# Altium schematic sheet Peripherals connectors.SchDoc
size A; SheetNumber: 3
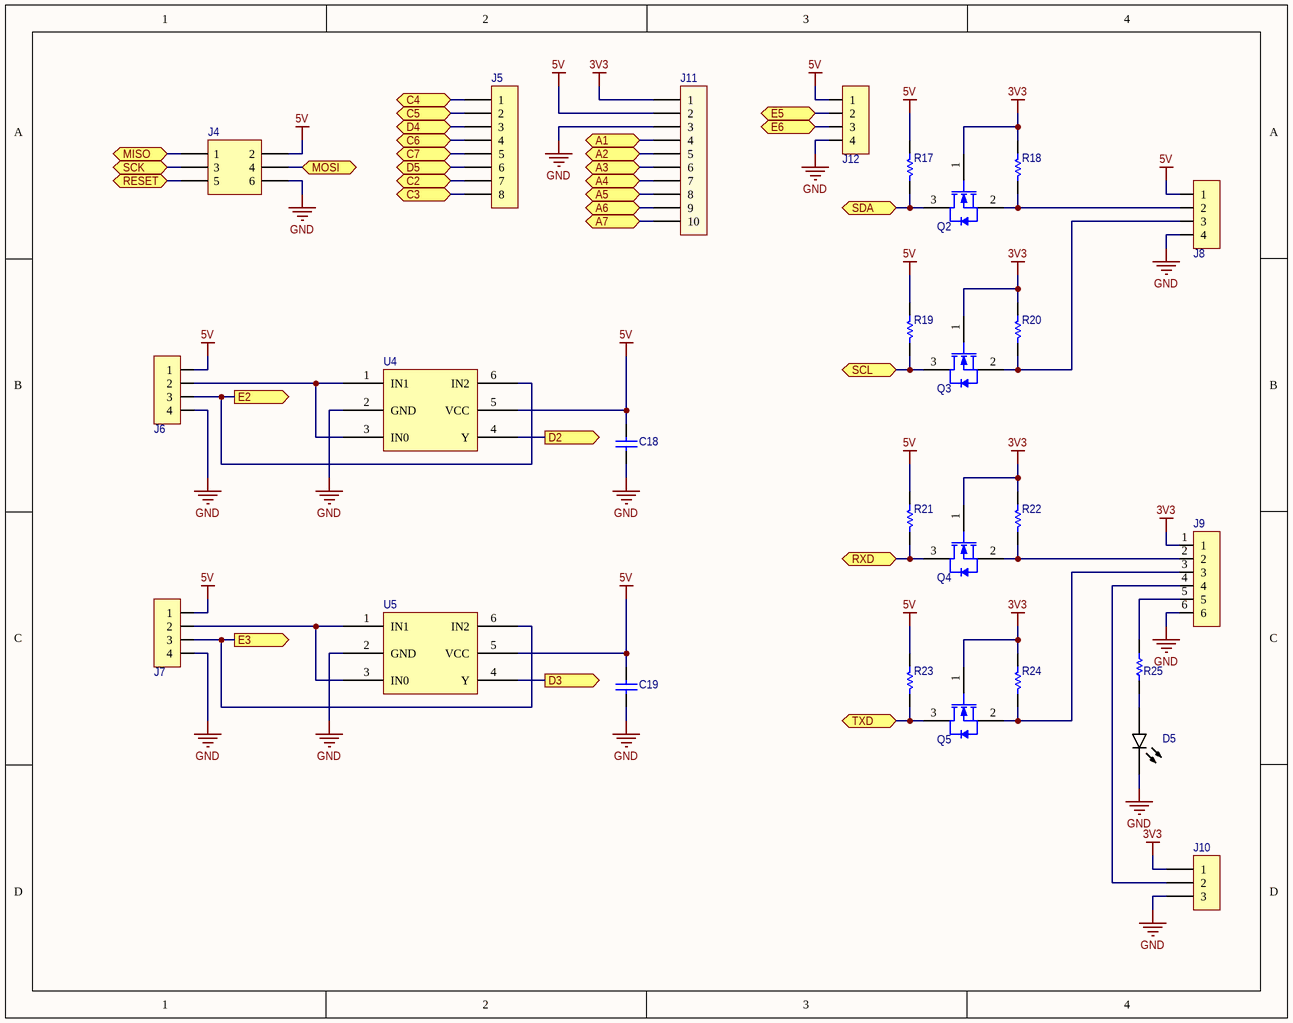
[diagram p0: Peripherals connectors.SchDoc]

## Parts
C18  Kemet C1206C104K5RACAUTO  [CAPC3216X88X50ML20T25]  (value not drawn)
C19  Kemet C1206C104K5RACAUTO  [CAPC3216X88X50ML20T25]  (value not drawn)
D5  Lite-On LTST-C170TBKT  [CHIPLED  0805 BLUE]  (value not drawn)
J4  FCI 67996-206HLF  [PCB-av458rj4t6vupn2hcvqe-1]  (value not drawn)
J5  Samtec MMS-108-01-L-SV  [PCB-goc1bdntoqdy8u4hrzei-1]  (value not drawn)
J6  4pin header  [PCBComponent_1 - duplicate]  (value not drawn)
J7  4pin header  [PCBComponent_1 - duplicate]  (value not drawn)
J8  4pin header  [PCBComponent_1 - duplicate]  (value not drawn)
J9  TE Connectivity / AMP 3-644456-5  [PCB-oudem42uhcimrbfznktg-1]  (value not drawn)
J10  Molex 75757-0431  [Molex 75757-0431]  (value not drawn)
J11  Jameco Valuepro 7000-1X10SG-R  [PCB-pv1vym0ok8u0vunn5wic-1]  (value not drawn)
J12  4pin header  [PCBComponent_1 - duplicate]  (value not drawn)
Q2  SYM-ec4d21f6be82338a-2  [PCB-fnvh88uh0gwuonmuoobt-1]  (value not drawn)
Q3  SYM-ec4d21f6be82338a-2  [PCB-fnvh88uh0gwuonmuoobt-1]  (value not drawn)
Q4  SYM-ec4d21f6be82338a-2  [PCB-fnvh88uh0gwuonmuoobt-1]  (value not drawn)
Q5  SYM-ec4d21f6be82338a-2  [PCB-fnvh88uh0gwuonmuoobt-1]  (value not drawn)
R17  Res1  [PCB-r93x9swl7vzrlon1kcic-1]  (value not drawn)
R18  Res1  [PCB-r93x9swl7vzrlon1kcic-1]  (value not drawn)
R19  Res1  [PCB-r93x9swl7vzrlon1kcic-1]  (value not drawn)
R20  Res1  [PCB-r93x9swl7vzrlon1kcic-1]  (value not drawn)
R21  Res1  [PCB-r93x9swl7vzrlon1kcic-1]  (value not drawn)
R22  Res1  [PCB-r93x9swl7vzrlon1kcic-1]  (value not drawn)
R23  Res1  [PCB-r93x9swl7vzrlon1kcic-1]  (value not drawn)
R24  Res1  [PCB-r93x9swl7vzrlon1kcic-1]  (value not drawn)
R25  Vishay Dale CRCW12061K00FKEB  [RESC3216X60X45ML10T20]  (value not drawn)
U4  Diodes Inc. 74LVC1G58W6-7  [PCB-s3ckst0z292py2klz87t-1]  (value not drawn)
U5  Diodes Inc. 74LVC1G58W6-7  [PCB-s3ckst0z292py2klz87t-1]  (value not drawn)

## Ports
A1, A2, A3, A4, A5, A6, A7, C2, C3, C4, C5, C6, C7, D2 (out), D3 (out), D4, D5, E2 (out), E3 (out), E5, E6, MISO, MOSI, RESET, RXD, SCK, SCL, SDA, TXD

## Nets
3V3: J9.1 J10.1 J11.1 Q2.1(G) Q3.1(G) Q4.1(G) Q5.1(G) R18.1 R20.1 R22.1 R24.1
5V: C18.1 C19.1 J4.2 J6.1 J7.1 J8.1 J11.2 J12.1 R17.1 R19.1 R21.1 R23.1 U4.5(VCC) U5.5(VCC)
GND: C18.2 C19.2 D5.2(K) J4.6 J6.4 J7.4 J8.4 J9.6 J10.3 J11.3 J12.4 U4.2(GND) U5.2(GND)
A1: J11.4 ; port A1
A2: J11.5 ; port A2
A3: J11.6 ; port A3
A4: J11.7 ; port A4
A5: J11.8 ; port A5
A6: J11.9 ; port A6
A7: J11.10 ; port A7
C2: J5.7 ; port C2
C3: J5.8 ; port C3
C4: J5.1 ; port C4
C5: J5.2 ; port C5
C6: J5.4 ; port C6
C7: J5.5 ; port C7
D2: U4.4(Y) ; port D2
D3: U5.4(Y) ; port D3
D4: J5.3 ; port D4
D5: J5.6 ; port D5
E2: J6.3 U4.6(IN2) ; port E2
E3: J7.3 U5.6(IN2) ; port E3
E5: J12.2 ; port E5
E6: J12.3 ; port E6
MISO: J4.1 ; port MISO
MOSI: J4.4 ; port MOSI
RESET: J4.5 ; port RESET
RXD: Q4.3(D) R21.2 ; port RXD
SCK: J4.3 ; port SCK
SCL: Q3.3(D) R19.2 ; port SCL
SDA: Q2.3(D) R17.2 ; port SDA
TXD: Q5.3(D) R23.2 ; port TXD
NetD5_1: D5.1(A) R25.1
NetJ6_2: J6.2 U4.1(IN1) U4.3(IN0)
NetJ7_2: J7.2 U5.1(IN1) U5.3(IN0)
NetJ8_2: J8.2 Q2.2(S) R18.2
NetJ8_3: J8.3 Q3.2(S) R20.2
NetJ9_2: J9.2 Q4.2(S) R22.2
NetJ9_3: J9.3 Q5.2(S) R24.2
NetJ9_4: J9.4 J10.2
NetJ9_5: J9.5 R25.2

## Library data of the parts
C18 C19 = C1206C104K5RACAUTO: Cap Ceramic 0.1uF 50V X7R 10% SMD 1206 125C Plastic T/R; Capacitance: 1e-07 F; Lead-Free Status: R; Voltage Rating (DC): 50.0 V; Manufacturer Part Number: C1206C104K5RACAUTO; Capacitance Tolerance: ±10%; Case/Package: 1206; Dielectric Characteristic: X7R; Dielectric Material: Ceramic; Mounting Style: Surface Mount; Octopart Url: https://octopart.com/c1206c104k5racauto-kemet-12595586; OctopartID: 2beee2243f0af429; Packaging: Cut Tape (CT); REACH SVHC Compliance: No SVHC; RoHS: Compliant
D5 = LTST-C170TBKT: Blue 2 x 1.25 x 1.1 mm 130° Water Clear 112 mcd 3.8 V LED Surface Mount; Forward Voltage: 3.30 V; Viewing Angle: 130 °; Size-Length: 2.00 mm; Size-Width: 1.25 mm; Color: Blue
J4 = CMP-bc8877e797ed634f-3: Conn Unshrouded Header HDR 6 POS 2.54mm Solder ST Thru-Hole Poly Bag; Number of Contacts: 6; Gender: Male; Contact Plating: Gold; Manufacturer Part Number: 67996-206HLF; RoHS: Compliant; Packaging: Bulk; OctopartID: bc8877e797ed634f; Mounting Style: Through Hole; Octopart URL: http://octopart.com/67996-206hlf-fci-40177155; Contact Material: Phosphor Bronze
J5 = CMP-11ccd8c2bcd6ce0b-2: Conn Socket Strip SKT 8 POS 2mm Solder ST Thru-Hole Tube; Number of Positions: 8; Lead-Free Status: Lead Free; Pin Pitch: 2.00 mm; Gender: Female; Number of Contacts: 8; Size-Width: 2.00 mm; RoHS: Compliant; Packaging: Tube; REACH SVHC Compliance: No SVHC; Mounting Style: Through Hole, Vertical; Contact Material: Phosphor Bronze; Housing Color: Black; Contact Plating: Gold; OctopartID: 11ccd8c2bcd6ce0b; Number of Rows: 1; Size-Height: 4.45 mm; Size-Length: 16.0 mm; Housing Material: Plastic; Manufacturer Part Number: MMS-108-01-L-SV; Octopart URL: http://octopart.com/mms-108-01-l-sv-samtec-297084
J6-J8 J12 = CMP-6785af82bd5db842-5: Conn Unshrouded Header HDR 4 POS 2.54mm Solder ST Thru-Hole C-Grid III™ Tray; Manufacturer Part Number: 0901200124; Gender: Male; Orientation: Straight; RoHS: Compliant; Mounting Style: Solder; Octopart URL: http://octopart.com/0901200124-molex-17694654; Contact Plating: Tin; OctopartID: 6785af82bd5db842
J9 = CMP-7ab1b1e1ad8ca576-9: MTA-100 Series 6 Position 2.54 mm Pitch Single Row Tin Plated Header; Lead-Free Status: Lead Free; Gender: Male; Mounting Angle: 180 °; ELV Compliant: Compliant; Voltage Rating (AC): 250 V; Shrouded: No; Number of Positions: 6; RoHS: Compliant; Housing Color: Natural; Flammability Rating: UL 94 V-0; Lifecycle Status: Active; Size-Width: 2.34 mm; Mounting Style: Through Hole, Vertical; OctopartID: 7ab1b1e1ad8ca576; Orientation: Vertical; Octopart URL: http://octopart.com/3-644456-6-te+connectivity+%2F+amp-39514715; Number of Rows: 1; Housing Material: Polyester; Number of Contacts: 6; Contact Material: Copper Alloy; Contact Plating: Tin
J10 = CMP-6ec4a6b2c126b103-1: Conn Unshrouded Header HDR 3 POS 3.5mm Solder ST Thru-Hole Tube; Current Rating: 16.0 A; Glow Wire Compliant: Non-Compliant; Number of Circuits: 3; Mounting Style: Through Hole; Orientation: Vertical; Octopart URL: http://octopart.com/75757-0431-molex-24939140; Lifecycle Status: Active; Halogen Free Status: Low Halogen; OctopartID: 6ec4a6b2c126b103
J11 = CMP-6671af580ca0b9b6-1: Header Straight Male 1 Row 10 Pin
Q2-Q5 = BSS138P,215: Transistor Polarity: n Channel; Drain Source Voltage Vds: 60V; Continuous Drain Current Id: 360Ma; On Resistance...; Lead-Free Status: Lead Free; Mounting Style: Surface Mount; Lifecycle Status: Active; Operating Temperature: -55.0 °C to 150 °C; RoHS: Compliant; OctopartID: ec4d21f6be82338a; Manufacturer Part Number: BSS138P,215; Number of Pins: 3
R17-R19 R21-R24 = CRCW120610K0FKTA: Res Thick Film 1206 10K Ohm 1% 1/4W ±100ppm/°C Molded SMD SMD Paper T/R; Resistance: 10.0 kΩ; Temperature Coefficient: -100 ppm/°C to 100 ppm/°C; Octopart URL: https://octopart.com/crcw120610k0fkta-vishay-40299249; Number of Pins: 2; Manufacturer Part Number: CRCW120610K0FKTA
R20 = CMP-1d37d65bd2a0c2f0-1: Res Thick Film 1206 10K Ohm 1% 1/4W ±100ppm/°C Molded SMD SMD Paper T/R; Manufacturer Part Number: CRCW120610K0FKTA; Resistance: 10.0 kΩ; Temperature Coefficient: -100 ppm/°C to 100 ppm/°C; Octopart URL: https://octopart.com/crcw120610k0fkta-vishay-40299249; Number of Pins: 2
R25 = CRCW12061K00FKEB: Thick Film Resistors - SMD 1/4watt 1Kohms 1%; Lead-Free Status: Lead Free; Power Rating: 0.25 W; Resistance: 1000.0 Ω; Voltage Rating (DC): 200.0 V; Case/Package: 1206; Number of Pins: 2; Octopart Url: https://octopart.com/crcw12061k00fkeb-vishay+dale-42466336; OctopartID: 6554aed9bc12ba93; Resistance Tolerance: ±1%; RoHS: Compliant; Manufacturer Part Number: CRCW12061K00FKEB
U4 U5 = 74LVC1G58W6-7: LOGIC, POS MULTI FUNC, 3 IP, SOT26; Logic Type: Configurable Multiple Function; O; Supply Voltage (DC): 1.65 V (min); Lead-Free Status: Lead Free; Number of Gates: 1; Octopart URL: http://octopart.com/74lvc1g58w6-7-diodes+inc.-20104502